# Altium schematic sheet board2.SchDoc
size A
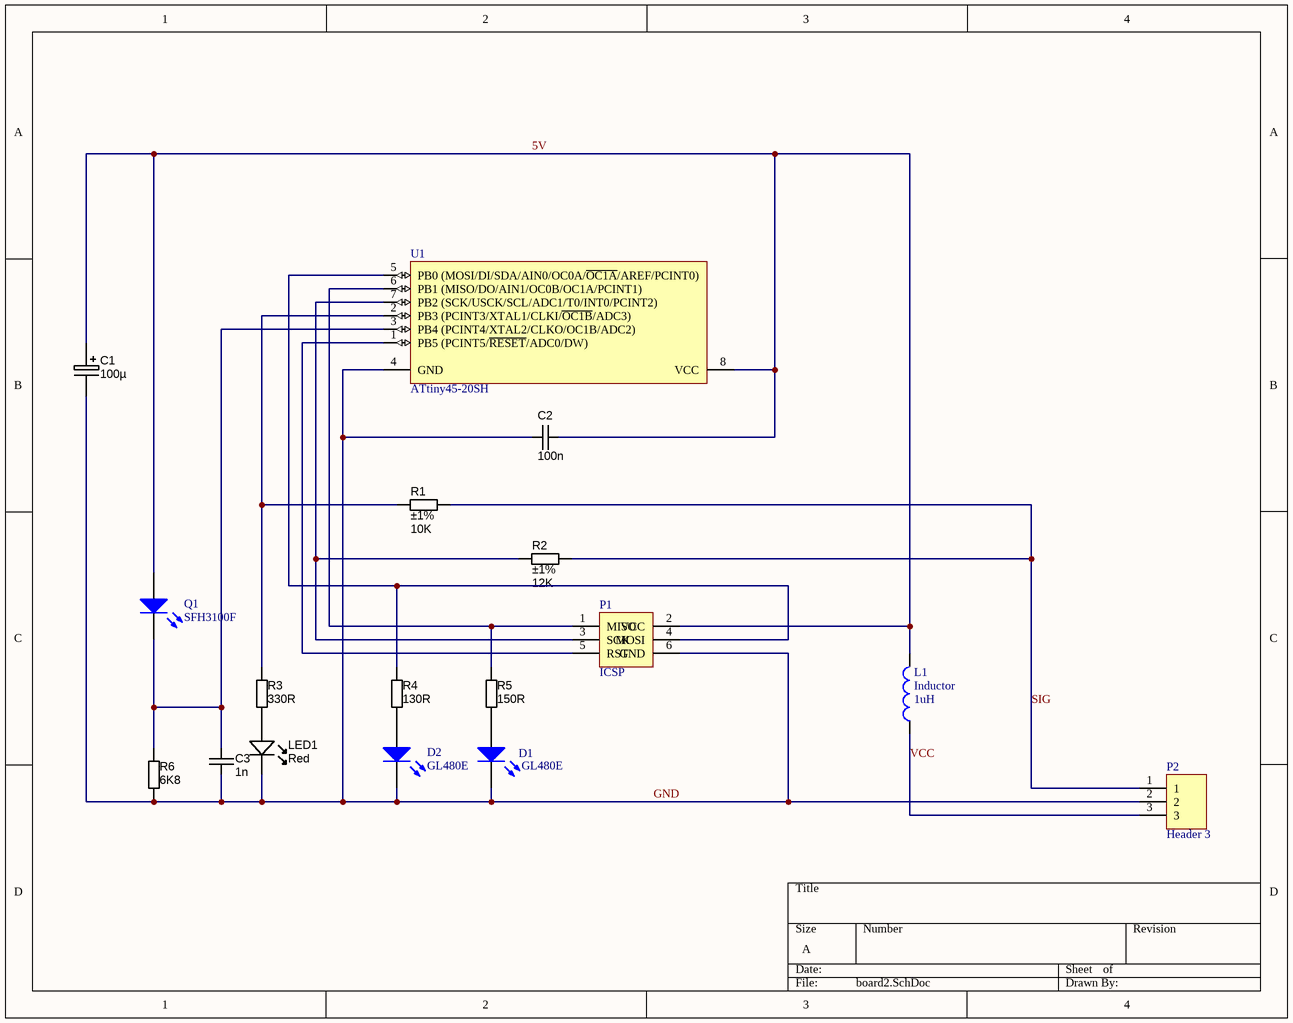
[diagram p0: board2.SchDoc]

## Parts
C1  100µ  [CAPAE200P550X1200_FLAT2]
C2  100n  [CAPC1005X55N]
C3  1n  [CAPC1005X55N]
D1  GL480E  [LED-0]
D2  GL480E  [LED-0]
L1  Inductor  value 1uH  [0402-A]
LED1  Red  [LED-0603-RED]
P1  ICSP  [HDR2X3]
P2  Header 3  [HDR1X3]
Q1  SFH3100F  [LED-0]
R1  value 10K  Tolerance: ±1%  [RESC1005X40N]  (hidden comment: Thick Film)
R2  value 12K  Tolerance: ±1%  [RESC1005X40N]  (hidden comment: Thick Film)
R3  value 330R  [RESC1608X55N]  (hidden comment: Thick Film)
R4  value 130R  [RESC1608X55N]  (hidden comment: Thick Film)
R5  value 150R  [RESC1608X55N]  (hidden comment: Thick Film)
R6  value 6K8  [RESC1608X55N]  (hidden comment: Thick Film)
U1  ATtiny45-20SH  [8S2_N]

## Nets
5V: C1.1 C2.2 L1.2 P1.2(VCC) Q1.1(A) U1.8(VCC)
GND: C1.2 C2.1 C3.2 D1.2(K) D2.2(K) LED1.K P1.6(GND) P2.2 R6.1 U1.4(GND)
SIG: P2.1 R1.2 R2.2
VCC: L1.1 P2.3
NetC3_1: C3.1 Q1.2(K) R6.2 U1.3(PB4_(PCINT4/XTAL2/CLKO/OC1B/ADC2))
NetD1_1: D1.1(A) R5.1
NetD2_1: D2.1(A) R4.1
NetLED1_A: LED1.A R3.2
NetP1_1: P1.1(MISO) R5.2 U1.6(PB1_(MISO/DO/AIN1/OC0B/OC1A/PCINT1))
NetP1_3: P1.3(SCK) R2.1 U1.7(PB2_(SCK/USCK/SCL/ADC1/T0/INT0/PCINT2))
NetP1_4: P1.4(MOSI) R4.2 U1.5(PB0_(MOSI/DI/SDA/AIN0/OC0A/~{OC1A}/AREF/PCINT0))
NetP1_5: P1.5(RST) U1.1(PB5_(PCINT5/~{RESET}/ADC0/DW))
NetR1_1: R1.1 R3.1 U1.2(PB3_(PCINT3/XTAL1/CLKI/~{OC1B}/ADC3))

## Library data of the parts
C1 = CAPE_100u_16V_THD: Capacitor THD Electrolytic 100uF 20% 16V Radial; Manufacturer: Panasonic - ECG; Manufacturer Part Number: ECA-1CM101; Material: Aluminum Electrolytic; SCDType: spec; Package / Case: Radial - Through hole; Ratings: 16V; Tolerance: ±20%; Supplier 1: Digi-Key; Supplier Part Number 1: P5138-ND; Value: 100µ
C2 = CAPC_100n_0402_X5R_16V_10%: Capacitor SMD Cer 100nF 10% 16V X5R 0402; Manufacturer 1: AVX Corporation; Manufacturer Part Number 1: 0402YD104KAT2A; Ratings: 16V; X5R; SCDType: spec; Tolerance: ±10%; Operating Temperature: -55°C ~ 125°C; Package / Case: 0402 (1005 Metric); Size / Dimension: 0.039" L x 0.020" W (1.00mm x 0.50mm); Supplier 1: Digi-Key; Supplier Part Number 1: 478-1126-1-ND; ComponentLink1URL: http://www.avx.com/docs/Catalogs/cx5r.pdf; ComponentLink1Description: http://www.avx.com/docs/Catalogs/cx5r.pdf; Supplier 2: Digi-Key; Supplier Part Number 2: 311-1347-1-ND; Manufacturer 2: Yageo; Manufacturer Part Number 2: CC0402KRX5R7BB104; ComponentLink2URL: http://www.yageo.com/documents/recent/UPY-GPHC_X5R_4V-to-50V_12.pdf; ComponentLink2Description: http://www.yageo.com/documents/recent/UPY-GPHC_X5R_4V-to-50V_12.pdf; Value: 100n
C3 = CAPC_1n_0402_X7R_16V_10%: Capacitor SMD Cer 1nF 10% 16V X7R 0402; Manufacturer 1: AVX Corporation; Manufacturer Part Number 1: 0402YC102KAT2A; Ratings: 16V; X7R; SCDType: spec; Tolerance: ±10%; Operating Temperature: -55°C ~ 125°C; Package / Case: 0402 (1005 Metric); Size / Dimension: 0.039" L x 0.020" W (1.00mm x 0.50mm); Manufacturer 2: Yageo; Manufacturer Part Number 2: CC0402KRX7R7BB102; Supplier 1: Digi-Key; Supplier Part Number 1: 478-6197-1-ND; ComponentLink1URL: http://www.avx.com/docs/Catalogs/cx7r.pdf; ComponentLink1Description: http://www.avx.com/docs/Catalogs/cx7r.pdf; Supplier 2: Digi-Key; Supplier Part Number 2: 311-1352-1-ND; ComponentLink2URL: http://www.yageo.com/documents/recent/UPY-GPHC_X7R_6.3V-to-50V_8.pdf; ComponentLink2Description: http://www.yageo.com/documents/recent/UPY-GPHC_X7R_6.3V-to-50V_8.pdf; Value: 1n
D1 D2 = LED0: Typical INFRARED GaAs LED; Published: 8-Jun-2000; LatestRevisionDate: 08-Jul-2005; LatestRevisionNote: Mech Layer 1 removed.; PackageReference: LED-0; Publisher: Altium Limited; PackageDescription: LED; 2 Leads
L1 = Inductor: Code_IEC: 1005; Published: 8-Jun-2000; LatestRevisionDate: 29-May-2009; LatestRevisionNote: IPC-7351 Footprint Added.; PackageReference: 0402-A; Publisher: Altium Limited; PackageDescription: Chip Inductor; Code_JEITA: 0402
LED1 = LED_SMD_Red_0603_220mcd: LED 0603 SMD Hyper Red 630nm 220mcd 20mA; Manufacturer 1: Kingbright Company LLC; Manufacturer Part Number 1: APT1608SURCK; Material: AlGaInP on GaAs; Ratings: 220 mcd; 630 nm; Voltage - Forward (Vf) Typ: 1.95V; Voltage - Forward (Vf) @ 10mA: 1.9V; SCDType: source; Package / Case: 0603 (1608 metric); Supplier 1: Digi-Key; Supplier Part Number 1: 754-1123-1-ND; ComponentLink1URL: http://www.us.kingbright.com/images/catalog/SPEC/APT1608SURCK.pdf; ComponentLink1Description: http://www.us.kingbright.com/images/catalog/SPEC/APT1608SURCK.pdf
P1 = Header 3X2: Header, 3-Pin, Dual row; LatestRevisionDate: 17-Jul-2002; LatestRevisionNote: Re-released for DXP Platform.; Publisher: Altium Limited
P2 = Header 3: Header, 3-Pin; LatestRevisionDate: 17-Jul-2002; LatestRevisionNote: Re-released for DXP Platform.; Publisher: Altium Limited
Q1 = LED0: IR Phototransistor; Published: 8-Jun-2000; LatestRevisionDate: 08-Jul-2005; LatestRevisionNote: Mech Layer 1 removed.; PackageReference: LED-0; Publisher: Altium Limited; PackageDescription: LED; 2 Leads
R1 R2 = RES_10K_0402_1%: Resistor SMD chip 10k Ohm 0.063W 1% 0402; Manufacturer 1: Vishay Dale; Manufacturer Part Number 1: CRCW040210K0FKED; Ratings: 1/16 W; SCDType: spec; Package / Case: 0402 (1005 Metric); Manufacturer 2: Yageo; Manufacturer Part Number 2: RC0402FR-0710KL; Supplier 1: Digi-Key; Supplier Part Number 1: 541-10.0KLCT-ND; ComponentLink1URL: http://www.vishay.com/doc?20035; ComponentLink1Description: http://www.vishay.com/doc?20035; Supplier 2: Digi-Key; Supplier Part Number 2: 311-10.0KLRCT-ND; ComponentLink2URL: http://www.yageo.com/documents/recent/PYu-RC0402_51_RoHS_L_6.pdf; ComponentLink2Description: http://www.yageo.com/documents/recent/PYu-RC0402_51_RoHS_L_6.pdf
R3 = RES_330R_0603_5%: Resistor SMD chip 330 Ohm 0.1W 5% 0603; Manufacturer 1: Vishay Dale; Manufacturer Part Number 1: CRCW0603330RJNEA; Ratings: 1/10 W; SCDType: spec; Manufacturer 2: Yageo; Manufacturer Part Number 2: RC0603JR-07330RL; Package / Case: 0603 (1608 metric); Tolerance: ±5%; Material: Thick Film; Supplier 1: Digi-Key; Supplier Part Number 1: 541-330GCT-ND; ComponentLink1URL: http://www.vishay.com/doc?20035; ComponentLink1Description: http://www.vishay.com/doc?20035; Supplier 2: Digi-Key; Supplier Part Number 2: 311-330GRCT-ND; ComponentLink2URL: http://www.yageo.com/documents/recent/PYu-RC0603_51_RoHS_L_4.pdf; ComponentLink2Description: http://www.yageo.com/documents/recent/PYu-RC0603_51_RoHS_L_4.pdf
R4-R6 = RES_2K2_0603_5%: Resistor SMD chip 2.2k Ohm 0.1W 5% 0603; Manufacturer 1: Yageo; Manufacturer Part Number 1: RC0603JR-072K2L; Ratings: 1/10 W; SCDType: spec; Temperature Coefficient: ±100ppm/°C; Package / Case: 0603 (1608 metric); Tolerance: ±5%; Material: Thick Film; Supplier 1: Digi-Key; Supplier Part Number 1: 311-2.2KGRDKR-ND; RoHS 1: RoHS Compliant; ComponentLink1URL: http://www.yageo.com/documents/recent/PYu-RC0603_51_RoHS_L_4.pdf; ComponentLink1Description: http://www.yageo.com/documents/recent/PYu-RC0603_51_RoHS_L_4.pdf; Supplier 2: Digi-Key; Supplier Part Number 2: 1276-5070-6-ND; Manufacturer 2: Samsung Electro-Mechanics America, Inc; Manufacturer Part Number 2: RC1608J222CS; RoHS 2: RoHS Compliant; ComponentLink2URL: http://www.samsungsem.com/servlet/FileDownload?filename=productcatalog/pdf/Chip_Resistor.pdf; ComponentLink2Description: http://www.samsungsem.com/servlet/FileDownload?filename=productcatalog/pdf/Chip_Resistor.pdf; Supplier 3: Digi-Key; Supplier Part Number 3: RMCF0603JT2K20DKR-ND; Manufacturer 3: Stackpole Electronics Inc; Manufacturer Part Number 3: RMCF0603JT2K20; RoHS 3: RoHS Compliant; ComponentLink3URL: http://www.seielect.com/Catalog/SEI-RMCF_RMCP.pdf; ComponentLink3Description: http://www.seielect.com/Catalog/SEI-RMCF_RMCP.pdf; Supplier 4: Digi-Key; Supplier Part Number 4: RHM2.2KCGDKR-ND; Manufacturer 4: Rohm Semiconductor; Manufacturer Part Number 4: MCR03ERTJ222; RoHS 4: RoHS Compliant; ComponentLink4URL: http://rohmfs.rohm.com/en/products/databook/datasheet/passive/resistor/chip_resistor/mcr_g.pdf; ComponentLink4Description: http://rohmfs.rohm.com/en/products/databook/datasheet/passive/resistor/chip_resistor/mcr_g.pdf; Supplier 5: Digi-Key; Supplier Part Number 5: P2.2KGDKR-ND; Manufacturer 5: Panasonic Electronic Components; Manufacturer Part Number 5: ERJ-3GEYJ222V; RoHS 5: RoHS Compliant; ComponentLink5URL: http://industrial.panasonic.com/www-cgi/jvcr13pz.cgi?E+PZ+3+AOA0001+ERJ3GEYJ222V+7+WW; ComponentLink5Description: http://industrial.panasonic.com/www-cgi/jvcr13pz.cgi?E+PZ+3+AOA0001+ERJ3GEYJ222V+7+WW
U1 = ATtiny45-20SH: 8-bit AVR Microcontroller, 20MHz, 2.7-5.5V, 4K Flash, 256 Bytes EEPROM, 256 Bytes SRAM, Industrial Grade (-40°C to 85°C), 8-Lead SOIC, Pb-Free; DatasheetVersion: revN, Apr-2011; PackageVersion: revF, Apr-2008; PackageReference: 8S2; PackageDescription: 8-Lead, 0.208" Body, Plastic Small Outline Package (EIAJ); ComponentLink1Description: Manufacturer URL; ComponentLink1URL: http://www.atmel.com/; ComponentLink2Description: ATtiny25/45/85 Datasheet; ComponentLink2URL: http://www.atmel.com/dyn/resources/prod_documents/doc2586.pdf; ComponentLink3Description: ATtiny25/45/85 Summary; ComponentLink3URL: http://www.atmel.com/dyn/resources/prod_documents/2586S.pdf